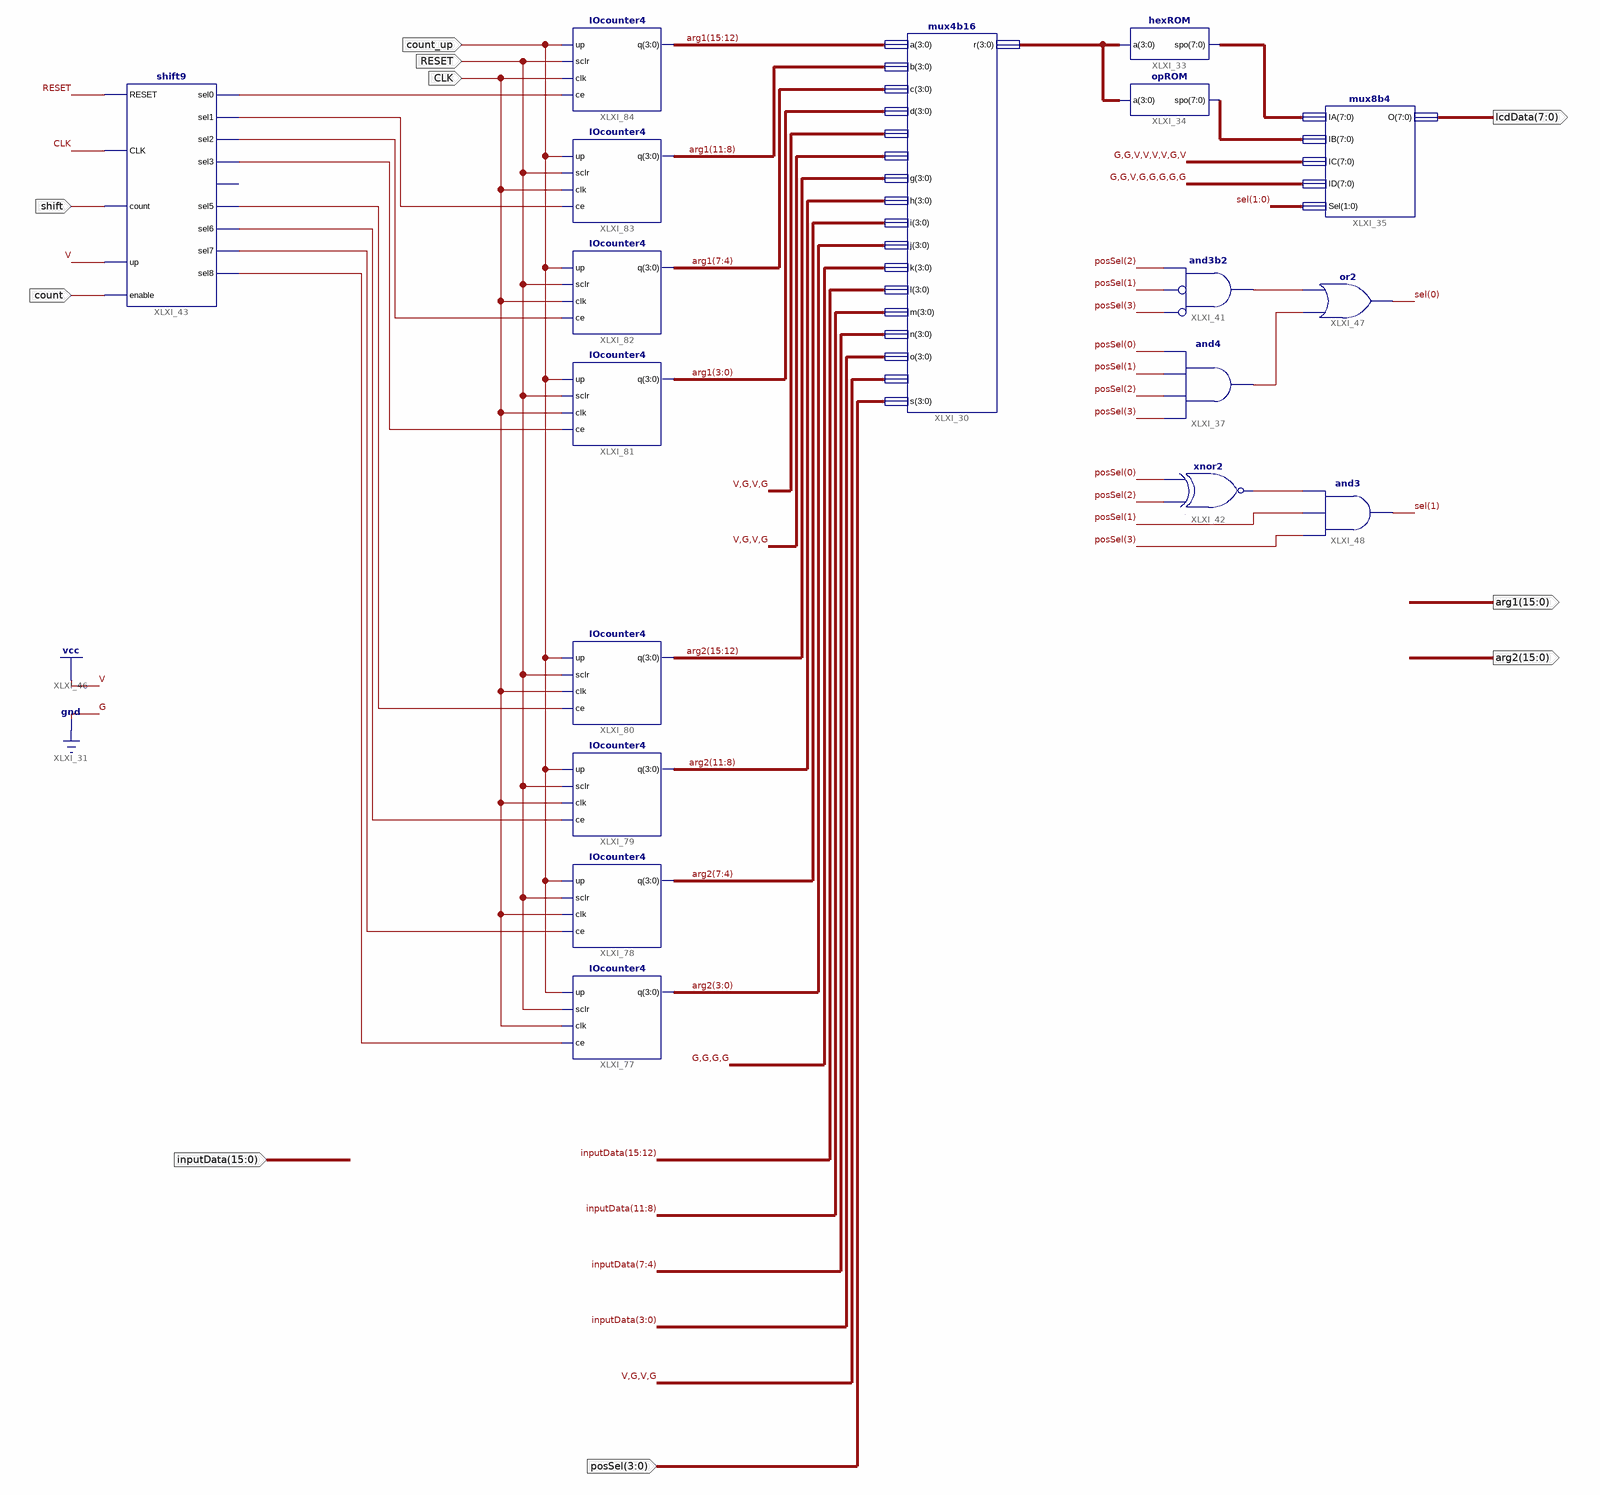
[diagram p0: schematic sheet 1]
// Xilinx ISE schematic input_2_hex_op.sch (spartan3e) as structural Verilog: 18 symbols, 10 ports
module input_2_hex_op (
  input  CLK,
  input  RESET,
  input  shift,
  input  count,
  input  [3:0] posSel,
  input  [15:0] inputData,
  input  count_up,
  output [7:0] lcdData,
  output [15:0] arg1,
  output [15:0] arg2
);

  wire XLXN_65, XLXN_66, XLXN_77, XLXN_82, XLXN_83, XLXN_84, XLXN_85, XLXN_87, XLXN_88, XLXN_89, XLXN_90;
  wire [1:0] sel;
  wire [3:0] XLXN_58;
  wire [7:0] XLXN_61, XLXN_62;

  mux4b16 XLXI_30 (
    .a(arg1[15:12]), .b(arg1[11:8]), .c(arg1[7:4]), .d(arg1[3:0]), .e(4'b1010), .f(4'b1010), .g(arg2[15:12]),
    .h(arg2[11:8]), .i(arg2[7:4]), .j(arg2[3:0]), .k(4'b0000), .l(inputData[15:12]), .m(inputData[11:8]),
    .n(inputData[7:4]), .o(inputData[3:0]), .p(4'b1010), .s(posSel), .r(XLXN_58));
  hexROM XLXI_33 (.a(XLXN_58), .spo(XLXN_62));
  opROM XLXI_34 (.a(XLXN_58), .spo(XLXN_61));
  mux8b4 XLXI_35 (.IA(XLXN_62), .IB(XLXN_61), .IC(8'b00111101), .ID(8'b00100000), .Sel(sel), .O(lcdData));
  shift9 XLXI_43 (
    .RESET(RESET), .CLK(CLK), .count(shift), .up(1'b1), .enable(count), .sel0(XLXN_82), .sel1(XLXN_83),
    .sel2(XLXN_84), .sel3(XLXN_85), .sel5(XLXN_87), .sel6(XLXN_88), .sel7(XLXN_89), .sel8(XLXN_90));  // open: sel4
  and XLXI_37 (XLXN_66, posSel[3], posSel[2], posSel[1], posSel[0]);
  and XLXI_41 (XLXN_65, ~posSel[3], ~posSel[1], posSel[2]);  // and3b2
  xnor XLXI_42 (XLXN_77, posSel[2], posSel[0]);
  or XLXI_47 (sel[0], XLXN_66, XLXN_65);
  and XLXI_48 (sel[1], posSel[3], posSel[1], XLXN_77);
  IOcounter4 XLXI_77 (.up(count_up), .sclr(RESET), .clk(CLK), .ce(XLXN_90), .q(arg2[3:0]));
  IOcounter4 XLXI_78 (.up(count_up), .sclr(RESET), .clk(CLK), .ce(XLXN_89), .q(arg2[7:4]));
  IOcounter4 XLXI_79 (.up(count_up), .sclr(RESET), .clk(CLK), .ce(XLXN_88), .q(arg2[11:8]));
  IOcounter4 XLXI_80 (.up(count_up), .sclr(RESET), .clk(CLK), .ce(XLXN_87), .q(arg2[15:12]));
  IOcounter4 XLXI_81 (.up(count_up), .sclr(RESET), .clk(CLK), .ce(XLXN_85), .q(arg1[3:0]));
  IOcounter4 XLXI_82 (.up(count_up), .sclr(RESET), .clk(CLK), .ce(XLXN_84), .q(arg1[7:4]));
  IOcounter4 XLXI_83 (.up(count_up), .sclr(RESET), .clk(CLK), .ce(XLXN_83), .q(arg1[11:8]));
  IOcounter4 XLXI_84 (.up(count_up), .sclr(RESET), .clk(CLK), .ce(XLXN_82), .q(arg1[15:12]));
endmodule
